# EAGLE design RTI-Dome-eth-ESP32 (EAGLE 9.7.0)

## Sheet 1 of 2
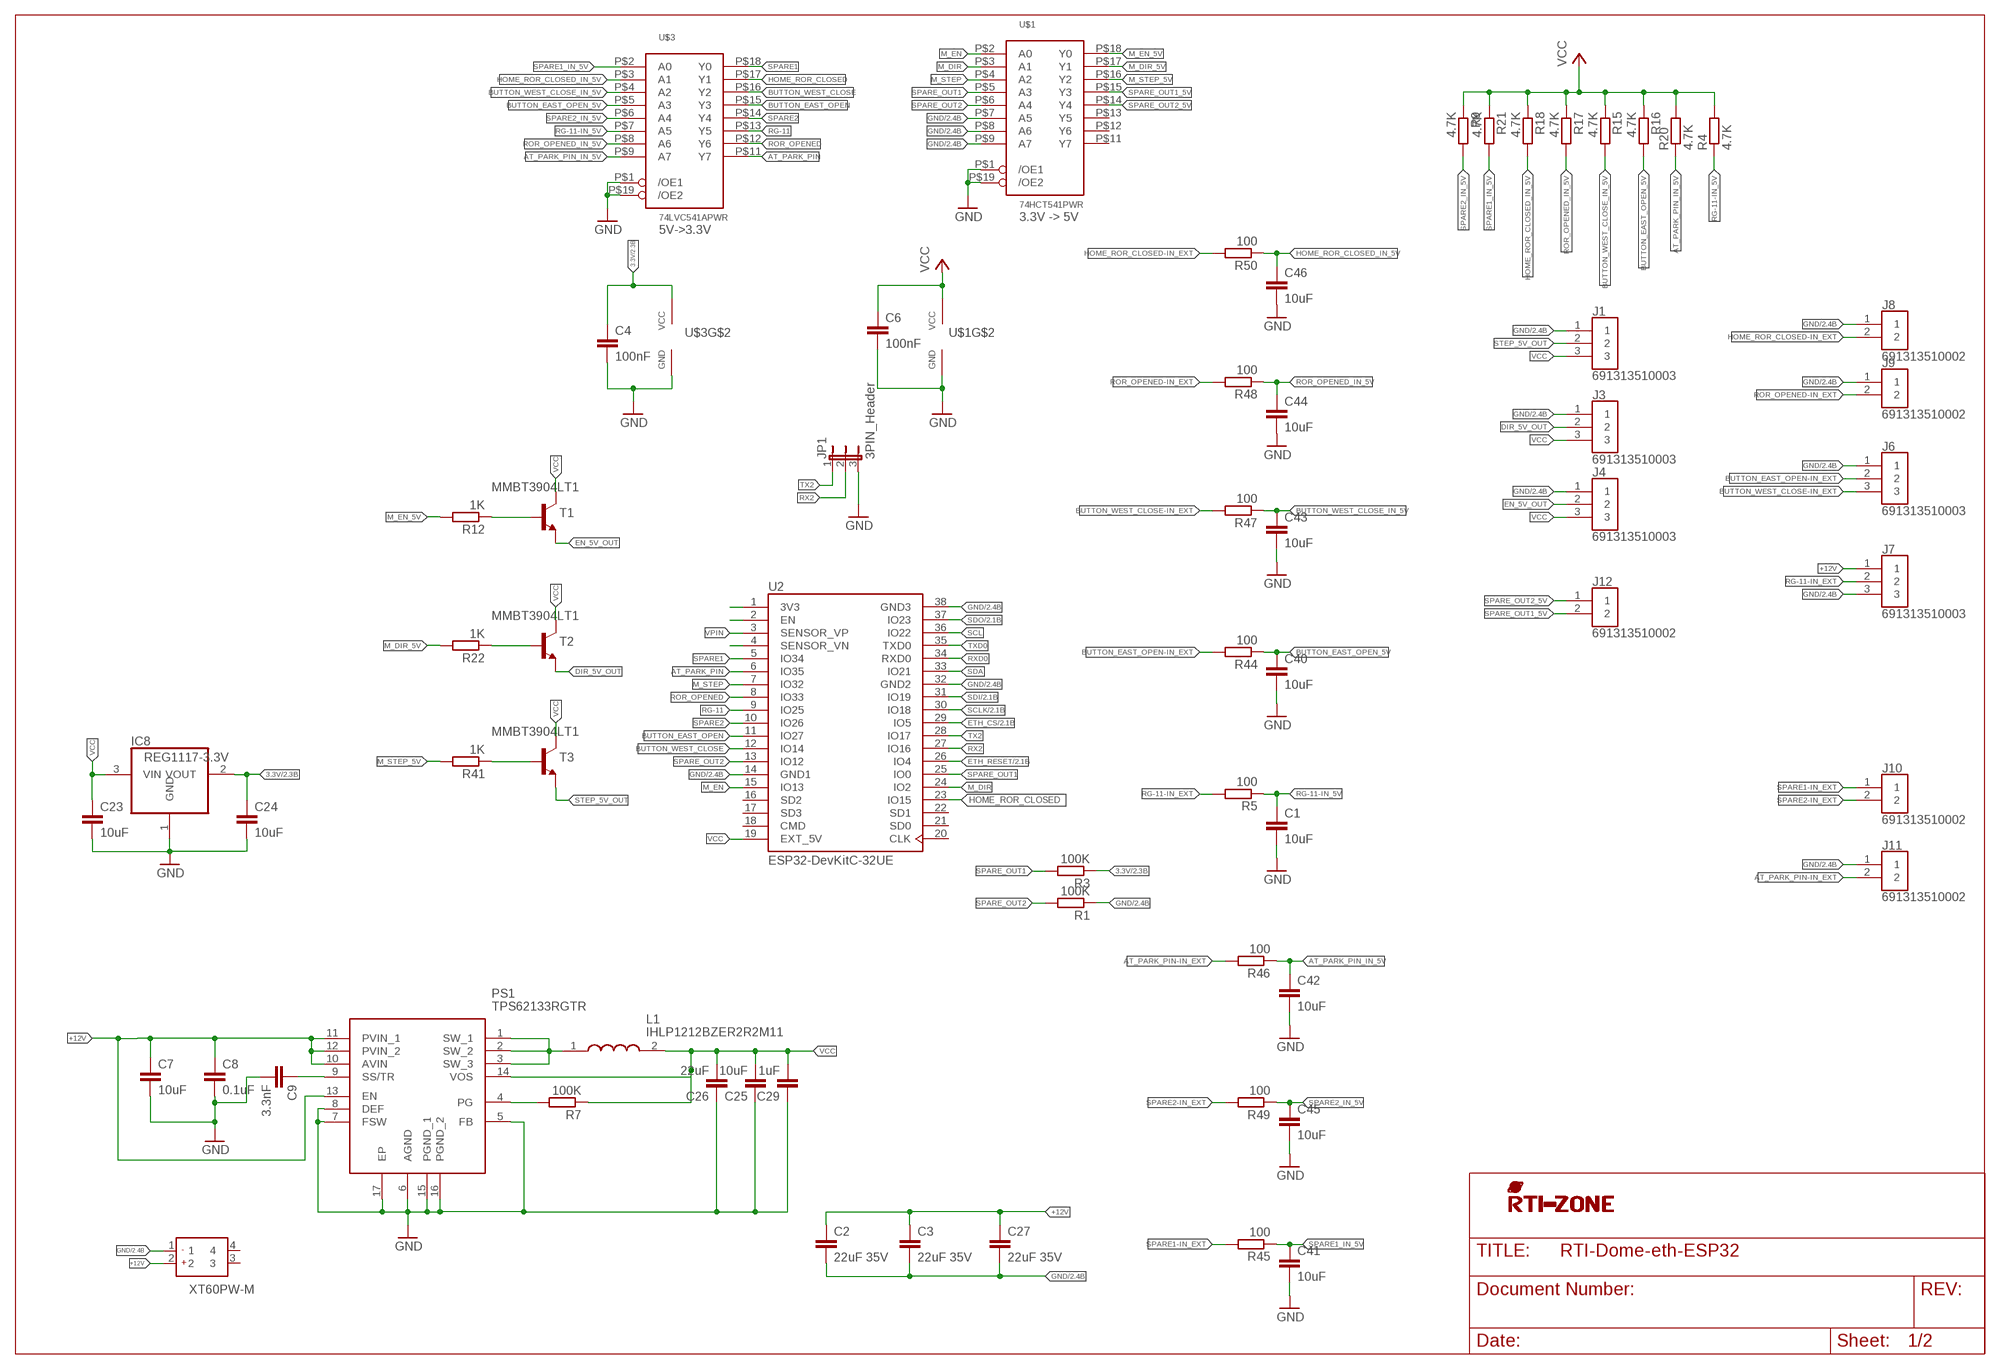
[diagram p0: schematic, sheet 1]

### Parts
C1  10uF  C-EUC0603  [C0603]
C2  22uF 35V  C-EUC1206  [C1206]
C3  22uF 35V  C-EUC1206  [C1206]
C4  100nF  C-EUC0603  [C0603]
C6  100nF  C-EUC0603  [C0603]
C7  10uF  C-EUC1206  [C1206]
C8  0.1uF  C-EUC1206  [C1206]
C9  3.3nF  C-EUC0805  [C0805]
C23  10uF  C-EUC0603  [C0603]
C24  10uF  C-EUC0603  [C0603]
C25  10uF  C-EUC0805  [C0805]
C26  22uF  C-EUC0805  [C0805]
C27  22uF 35V  C-EUC1206  [C1206]
C29  1uF  C-EUC0805  [C0805]
C40  10uF  C-EUC0603  [C0603]
C41  10uF  C-EUC0603  [C0603]
C42  10uF  C-EUC0603  [C0603]
C43  10uF  C-EUC0603  [C0603]
C44  10uF  C-EUC0603  [C0603]
C45  10uF  C-EUC0603  [C0603]
C46  10uF  C-EUC0603  [C0603]
IC8  REG1117-3.3V  REG1117  [SOT223]
J1  691313510003  [691313510003]
J2  XT60PW-M  [XT60PWM]
J3  691313510003  [691313510003]
J4  691313510003  [691313510003]
J6  691313510003  [691313510003]
J7  691313510003  [691313510003]
J8  691313510002  [SHDRRA2W100P0X508_1X2_1216X120]
J9  691313510002  [SHDRRA2W100P0X508_1X2_1216X120]
J10  691313510002  [SHDRRA2W100P0X508_1X2_1216X120]
J11  691313510002  [SHDRRA2W100P0X508_1X2_1216X120]
J12  691313510002  [SHDRRA2W100P0X508_1X2_1216X120]
JP1  3PIN_Header  JP2E  [JP2]
L1  IHLP1212BZER2R2M11  [INDPM3630X200N]
PS1  TPS62133RGTR  [QFN50P300X300X100-17N]
R1  100K  R-EU'0603'  [R0603]
R3  100K  R-EU'0603'  [R0603]
R4  4.7K  R-EU_R0603  [R0603]
R5  100  R-EU_R0603  [R0603]
R7  100K  R-EU_R0603  [R0603]
R9  4.7K  R-EU_R0603  [R0603]
R12  1K  R-EU_R0603  [R0603]
R15  4.7K  R-EU_R0603  [R0603]
R16  4.7K  R-EU_R0603  [R0603]
R17  4.7K  R-EU_R0603  [R0603]
R18  4.7K  R-EU_R0603  [R0603]
R20  4.7K  R-EU_R0603  [R0603]
R21  4.7K  R-EU_R0603  [R0603]
R22  1K  R-EU_R0603  [R0603]
R41  1K  R-EU_R0603  [R0603]
R44  100  R-EU_R0603  [R0603]
R45  100  R-EU_R0603  [R0603]
R46  100  R-EU_R0603  [R0603]
R47  100  R-EU_R0603  [R0603]
R48  100  R-EU_R0603  [R0603]
R49  100  R-EU_R0603  [R0603]
R50  100  R-EU_R0603  [R0603]
T1  MMBT3904LT1  [SOT23]
T2  MMBT3904LT1  [SOT23]
T3  MMBT3904LT1  [SOT23]
U2  ESP32-DevKitC-32UE  ESP32-DEVKITC-32U  [MODULE_ESP32-DEVKITC-32U]
U$1  74HCT541PWR  74541B  [TSSOP20]
U$3  74LVC541APWR  74541B  [TSSOP20]
U$4  RTI-LOGO_BIG  [LOGO_BIG]

### Nets
3.3V: C4.1 C24.1 IC8.2(VOUT) R3.1 U$3.P$20(VCC) ; also sheet 2
+12V [+12V]: C2.1 C3.1 C7.1 C8.1 C27.1 J2.2 J7.1 PS1.10(AVIN) PS1.11(PVIN_1) PS1.12(PVIN_2) PS1.13(EN)
AT_PARK_PIN: U2.6(IO35) U$3.P$11(Y7)
AT_PARK_PIN-IN_EXT: J11.2 R46.2
AT_PARK_PIN_IN_5V: C42.1 R20.1 R46.1 U$3.P$9(A7)
BUTTON_EAST_OPEN: U2.11(IO27) U$3.P$15(Y3)
BUTTON_EAST_OPEN-IN_EXT: J6.2 R44.2
BUTTON_EAST_OPEN_5V: C40.1 R16.2 R44.1 U$3.P$5(A3)
BUTTON_WEST_CLOSE: U2.12(IO14) U$3.P$16(Y2)
BUTTON_WEST_CLOSE-IN_EXT: J6.3 R47.2
BUTTON_WEST_CLOSE_IN_5V: C43.1 R15.2 R47.1 U$3.P$4(A2)
DIR-5V_TR: R22.1 T2.1(B)
DIR_5V_OUT: J3.2 T2.2(E)
EN-5V_TR: R12.1 T1.1(B)
EN_5V_OUT: J4.2 T1.2(E)
ETH_CS: U2.29(IO5) ; also sheet 2
ETH_RESET: U2.26(IO4) ; also sheet 2
GND [GND]: C1.2 C2.2 C3.2 C4.2 C6.2 C7.2 C8.2 C9.2 C23.2 C24.2 C25.1 C26.1 C27.2 C29.1 C40.2 C41.2 C42.2 C43.2 C44.2 C45.2 C46.2 IC8.1(GND) J1.1 J2.1 J3.1 J4.1 J6.1 J7.3 J8.1 J9.1 J11.1 JP1.3 PS1.5(FB) PS1.6(AGND) PS1.7(FSW) PS1.8(DEF) PS1.15(PGND_1) PS1.16(PGND_2) PS1.17(EP) R1.1 U2.14(GND1) U2.32(GND2) U2.38(GND3) U$1.P$1(/OE1) U$1.P$7(A5) U$1.P$8(A6) U$1.P$9(A7) U$1.P$10(GND) U$1.P$19(/OE2) U$3.P$1(/OE1) U$3.P$10(GND) U$3.P$19(/OE2) ; also sheet 2
HOME_ROR_CLOSED: U2.23(IO15) U$3.P$17(Y1)
HOME_ROR_CLOSED-IN_EXT: J8.2 R50.2
HOME_ROR_CLOSED_IN_5V: C46.1 R18.2 R50.1 U$3.P$3(A1)
M_DIR: U2.24(IO2) U$1.P$3(A1)
M_DIR_5V: R22.2 U$1.P$17(Y1)
M_EN: U2.15(IO13) U$1.P$2(A0)
M_EN_5V: R12.2 U$1.P$18(Y0)
M_STEP: U2.7(IO32) U$1.P$4(A2)
M_STEP_5V: R41.2 U$1.P$16(Y2)
N$20: U2.1(3V3)
N$21: U2.2(EN)
N$36: U2.4(SENSOR_VN)
PG: PS1.4(PG) R7.2
RG-11: U2.9(IO25) U$3.P$13(Y5)
RG-11-IN_5V: C1.1 R4.1 R5.1 U$3.P$7(A5)
RG-11-IN_EXT: J7.2 R5.2
ROR_OPENED: U2.8(IO33) U$3.P$12(Y6)
ROR_OPENED-IN_EXT: J9.2 R48.2
ROR_OPENED_IN_5V: C44.1 R17.2 R48.1 U$3.P$8(A6)
RX2: JP1.2 U2.27(IO16)
RXD0: U2.34(RXD0)
SCL: U2.36(IO22)
SCLK: U2.30(IO18) ; also sheet 2
SDA: U2.33(IO21)
SDI: U2.31(IO19) ; also sheet 2
SDO: U2.37(IO23) ; also sheet 2
SPARE1: U2.5(IO34) U$3.P$18(Y0)
SPARE1-IN_EXT: J10.1 R45.2
SPARE1_IN_5V: C41.1 R21.2 R45.1 U$3.P$2(A0)
SPARE2: U2.10(IO26) U$3.P$14(Y4)
SPARE2-IN_EXT [GND]: J10.2 R49.2
SPARE2_IN_5V [GND]: C45.1 R9.2 R49.1 U$3.P$6(A4)
SPARE_OUT1: R3.2 U2.25(IO0) U$1.P$5(A3)
SPARE_OUT1_5V: J12.2 U$1.P$15(Y3)
SPARE_OUT2: R1.2 U2.13(IO12) U$1.P$6(A4)
SPARE_OUT2_5V: J12.1 U$1.P$14(Y4)
SS/TR: C9.1 PS1.9(SS/TR)
STEP-5V_TR: R41.1 T3.1(B)
STEP_5V_OUT: J1.2 T3.2(E)
SW: L1.1 PS1.1(SW_1) PS1.2(SW_2) PS1.3(SW_3)
TX2: JP1.1 U2.28(IO17)
TXD0: U2.35(TXD0)
VCC: C6.1 C23.1 C25.2 C26.2 C29.2 IC8.3(VIN) J1.3 J3.3 J4.3 L1.2 PS1.14(VOS) R4.2 R7.1 R9.1 R15.1 R16.1 R17.1 R18.1 R20.2 R21.1 T1.3(C) T2.3(C) T3.3(C) U2.19(EXT_5V) U$1.P$20(VCC)
VPIN: U2.3(SENSOR_VP)
Unconnected: J2.3 J2.4 U2.16(SD2) U2.17(SD3) U2.18(CMD) U2.20(CLK) U2.21(SD0) U2.22(SD1) U$1.P$11(Y7) U$1.P$12(Y6) U$1.P$13(Y5)

### Notes on the sheet
- 3.3V -> 5V
- 5V->3.3V

## Sheet 2 of 2
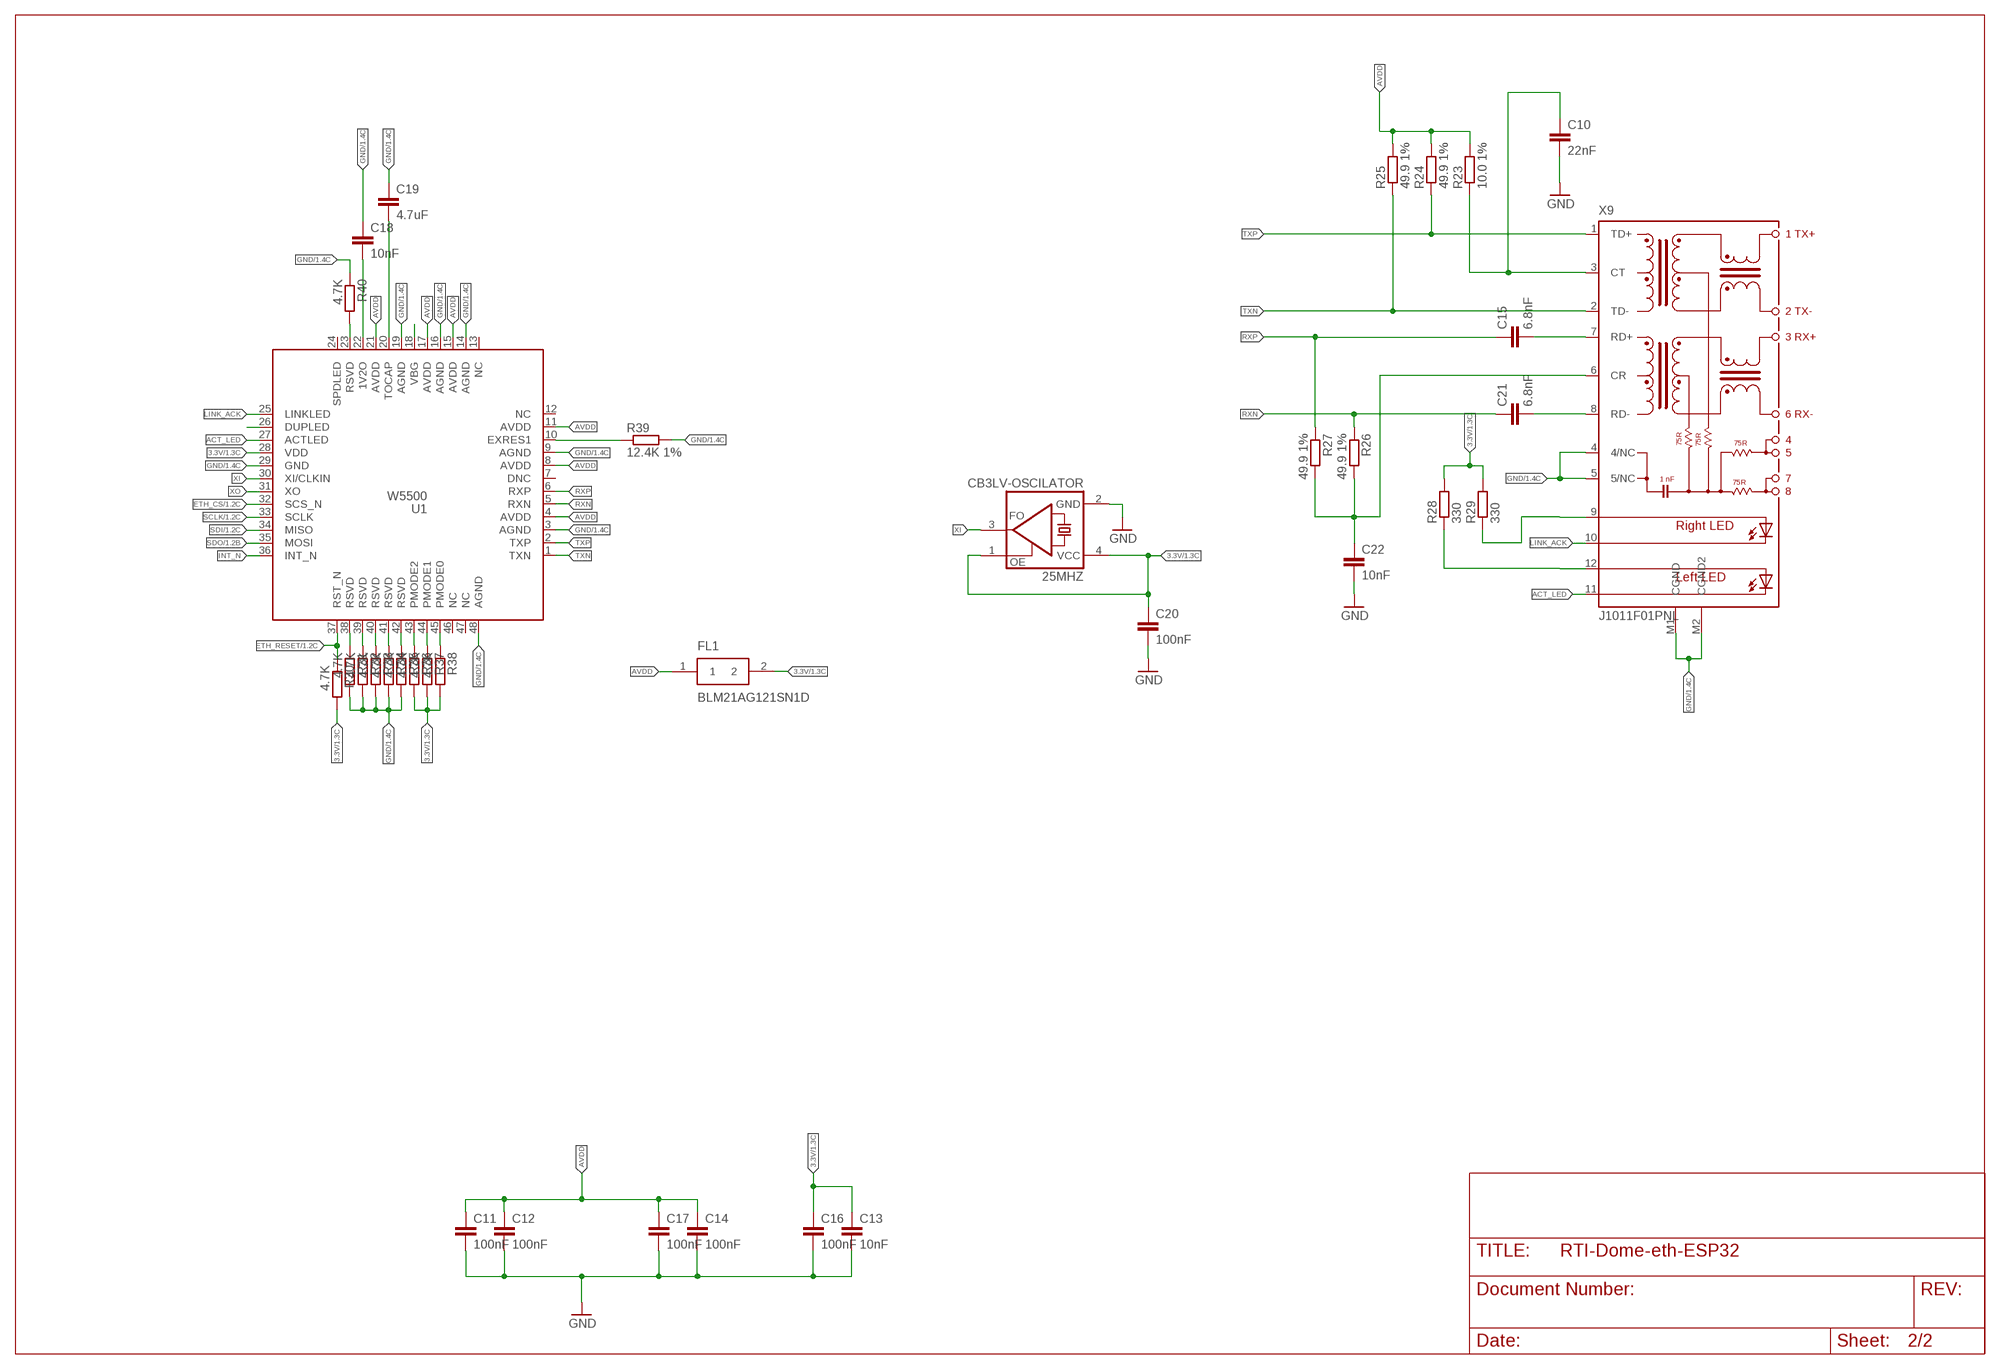
[diagram p1: schematic, sheet 2]

### Parts
25MHZ  CB3LV-OSCILATOR  [SMD-7050_4P]
C10  22nF  C-EUC0603  [C0603]
C11  100nF  C-EUC0603  [C0603]
C12  100nF  C-EUC0603  [C0603]
C13  10nF  C-EUC0603  [C0603]
C14  100nF  C-EUC0603  [C0603]
C15  6.8nF  C-EUC0603  [C0603]
C16  100nF  C-EUC0603  [C0603]
C17  100nF  C-EUC0603  [C0603]
C18  10nF  C-EUC0603  [C0603]
C19  4.7uF  C-EUC0603  [C0603]
C20  100nF  C-EUC0603  [C0603]
C21  6.8nF  C-EUC0603  [C0603]
C22  10nF  C-EUC0603  [C0603]
FL1  BLM21AG121SN1D  [L0805]
R23  10.0 1%  R-EU_R0603  [R0603]
R24  49.9 1%  R-EU_R0603  [R0603]
R25  49.9 1%  R-EU_R0603  [R0603]
R26  49.9 1%  R-EU_R0603  [R0603]
R27  49.9 1%  R-EU_R0603  [R0603]
R28  330  R-EU_R0603  [R0603]
R29  330  R-EU_R0603  [R0603]
R30  4.7K  R-EU_R0603  [R0603]
R31  4.7K  R-EU_R0603  [R0603]
R32  4.7K  R-EU_R0603  [R0603]
R33  4.7K  R-EU_R0603  [R0603]
R34  4.7K  R-EU_R0603  [R0603]
R35  4.7K  R-EU_R0603  [R0603]
R36  4.7K  R-EU_R0603  [R0603]
R37  4.7K  R-EU_R0603  [R0603]
R38  4.7K  R-EU_R0603  [R0603]
R39  12.4K 1%  R-EU_R0603  [R0603]
R40  4.7K  R-EU_R0603  [R0603]
U1  W5500  [LQFP48]
X9  J1011F01PNL  [J1011F01PNL]

### Nets
3.3V: 25MHZ.1(OE) 25MHZ.4(VDD) C13.1 C16.1 C20.1 FL1.2 R28.2 R29.2 R30.2 R36.2 R37.2 R38.2 U1.28(VDD) ; also sheet 1
ACT_LED: U1.27(ACTLED) X9.11(C-L)
AVDD: C11.1 C12.1 C14.1 C17.1 FL1.1 R23.2 R24.2 R25.2 U1.4(AVDD) U1.8(AVDD) U1.11(AVDD) U1.15(AVDD) U1.17(AVDD) U1.21(AVDD)
CR [+3V3]: C22.1 R26.2 R27.2 X9.6(CR)
CT [+3V3]: C10.1 R23.1 X9.3(CT)
ETH_CS: U1.32(SCS_N) ; also sheet 1
ETH_RESET: R30.1 U1.37(RST_N) ; also sheet 1
GND [GND]: 25MHZ.2(GND) C10.2 C11.2 C12.2 C13.2 C14.2 C16.2 C17.2 C18.1 C19.1 C20.2 C22.2 R31.2 R32.2 R33.2 R34.2 R35.2 R39.2 R40.1 U1.3(AGND) U1.9(AGND) U1.14(AGND) U1.16(AGND) U1.19(AGND) U1.29(GND) U1.48(AGND) X9.4(4/NC) X9.5(5/NC) X9.M1(CGND) X9.M2(CGND2) ; also sheet 1
INT_N: U1.36(INT_N)
L_LED+: R28.1 X9.12(AL)
LINK_ACK: U1.25(LINKLED) X9.10(C-R)
N$17: U1.26(DUPLED)
N$22: R31.1 U1.38(RSVD)
N$23: R32.1 U1.39(RSVD)
N$24: R33.1 U1.40(RSVD)
N$25: R34.1 U1.41(RSVD)
N$26: R35.1 U1.42(RSVD)
N$27: R36.1 U1.43(PMODE2)
N$28: R37.1 U1.44(PMODE1)
N$29: R38.1 U1.45(PMODE0)
N$31: C19.2 U1.20(TOCAP)
N$32: U1.18(VBG)
N$33: C18.2 U1.22(1V2O)
N$34: R39.1 U1.10(EXRES1)
N$35: R40.2 U1.23(RSVD)
R_LED+: R29.1 X9.9(A-R)
RD+: C15.2 X9.7(RD+)
RD-: C21.2 X9.8(RD-)
RXN: C21.1 R26.1 U1.5(RXN)
RXP: C15.1 R27.1 U1.6(RXP)
SCLK: U1.33(SCLK) ; also sheet 1
SDI: U1.34(MISO) ; also sheet 1
SDO: U1.35(MOSI) ; also sheet 1
TXN [diff]: R25.1 U1.1(TXN) X9.2(TD-)
TXP: R24.1 U1.2(TXP) X9.1(TD+)
XI: 25MHZ.3(FO) U1.30(XI/CLKIN)
XO: U1.31(XO)
Unconnected: U1.7(DNC) U1.12(NC) U1.13(NC) U1.24(SPDLED) U1.46(NC) U1.47(NC)

## Library data of the parts
25MHZ = rti:CB3LV-OSCILATOR; MPN: CB3LV-3I-25M0000
C1 C23 C24 C40-C46 = rcl:C-EU: CAPACITOR, European symbol; MPN: CC0805KKX5R8BB106; SPICEPREFIX: C
C2 C3 C7-C9 C25-C27 C29 = rcl:C-EU: CAPACITOR, European symbol; SPICEPREFIX: C
C4 C6 C11 C12 C14 C16 C17 C20 = rcl:C-EU: CAPACITOR, European symbol; MPN: 0805YD104KAT2A; SPICEPREFIX: C
C10 = rcl:C-EU: CAPACITOR, European symbol; MPN: CC0805JRX7R8BB223; SPICEPREFIX: C
C13 C18 C22 = rcl:C-EU: CAPACITOR, European symbol; MPN: CC0805KRX7R9BB103; SPICEPREFIX: C
C15 C21 = rcl:C-EU: CAPACITOR, European symbol; MPN: C0805C682F4HACTU; SPICEPREFIX: C
C19 = rcl:C-EU: CAPACITOR, European symbol; MPN: C0805C475J3RACTU; SPICEPREFIX: C
FL1 = BLM21AG121SN1D:BLM21AG121SN1D: BLM21_N1D Series EMI Suppression Filter 120+/-25% at 100MHz 1A @85 Source: Datasheet <https://www.murata.com/en-us/products/productdetail?partno=BLM21AG121SN1#>; MPN: BLM21AG121SN1D
IC8 = burr-brown:REG1117: 800mA and 1A Low Dropout (LDO) Positive Regulator 1.8V, 2.5V, 2.85V, 3.3V, 5V, and Adj; MPN: REG1117-3.3/2K5; OC_FARNELL: 1097566; OC_NEWARK: 14P6981
J1 J3 J4 J6 J7 = samacsys:691313510003: Wurth Elektronik 313 Series 5.08mm Pitch Straight Pluggable Terminal Block, PCB Header, Through Hole, 3 Way Source: Datasheet <https://katalog.we-online.de/em/datasheet/6913135100xx.pdf>; DESCRIPTION: Wurth Elektronik 313 Series 5.08mm Pitch Straight Pluggable Terminal Block, PCB Header, Through Hole, 3 Way; HEIGHT: 8.7mm; MANUFACTURER_NAME: Wurth Elektronik; MANUFACTURER_PART_NUMBER: 691313510003; MOUSER_PART_NUMBER: 710-691313510003; MOUSER_PRICE-STOCK: https://www.mouser.co.uk/ProductDetail/Wurth-Elektronik/691313510003?qs=E2PpAYvlWVuriHHnVOgTEg%3D%3D
J2 = samacsys:XT60PW-M: Socket; DC supply; XT60; male; PIN: 2; on PCBs; THT; Colour: yellow Source: Datasheet <https://www.tme.eu/Document/9b8d0c5eb7094295f3d3112c214d3ade/XT60PW SPEC.pdf>; DESCRIPTION: Socket; DC supply; XT60; male; PIN: 2; on PCBs; THT; Colour: yellow; HEIGHT: 8.4mm; LCSC_PART: C98732; MANUFACTURER_NAME: Changzou Amass Elec; MANUFACTURER_PART_NUMBER: XT60PW-M; MPN: XT60PW-M
J8-J12 = samacsys:691313510002: 2 Position Terminal Block Header, Male Pins, Shrouded (4 Side) 0.200" (5.08mm) 90, Right Angle Through Hole Source: Datasheet <https://www.we-online.de/katalog/datasheet/6913135100xx.pdf>; DESCRIPTION: 2 Position Terminal Block Header, Male Pins, Shrouded (4 Side) 0.200" (5.08mm) 90, Right Angle Through Hole; HEIGHT: 8.5mm; MANUFACTURER_NAME: Wurth Elektronik; MANUFACTURER_PART_NUMBER: 691313510002; MOUSER_PART_NUMBER: 710-691313510002; MOUSER_PRICE-STOCK: https://www.mouser.co.uk/ProductDetail/Wurth-Elektronik/691313510002?qs=2kOmHSv6VfR6BrMDgUh3kQ%3D%3D
JP1 = rti:JP2E: JUMPER; LCSC_PART: C19190477
L1 = samacsys:IHLP1212BZER2R2M11: Vishay IHLP1212BZ-11 Series Shielded Wire-wound SMD Inductor with a Metal Composite Core, 2.2 uH +/-20% Wire-Wound 3A Idc Source: Datasheet <https://www.vishay.com/docs/34289/lp12bz11.pdf>; ARROW_PART_NUMBER: IHLP1212BZER2R2M11; ARROW_PRICE-STOCK: https://www.arrow.com/en/products/ihlp1212bzer2r2m11/vishay?region=nac; DESCRIPTION: Vishay IHLP1212BZ-11 Series Shielded Wire-wound SMD Inductor with a Metal Composite Core, 2.2 uH +/-20% Wire-Wound 3A Idc; HEIGHT: 2mm; LCSC_PART: C553996; MANUFACTURER_NAME: Vishay; MANUFACTURER_PART_NUMBER: IHLP1212BZER2R2M11; MOUSER_PART_NUMBER: 70-IHLP1212BZER2R2M1; MOUSER_PRICE-STOCK: https://www.mouser.co.uk/ProductDetail/Vishay-Dale/IHLP1212BZER2R2M11?qs=OXt1GPNndFc1xOXvysj2ew%3D%3D
PS1 = samacsys:TPS62133RGTR: 3-17V 3A Step-Down Converter in 3x3 QFN Package Source: Datasheet <http://www.ti.com/lit/gpn/tps62133>; ARROW_PART_NUMBER: TPS62133RGTR; ARROW_PRICE-STOCK: https://www.arrow.com/en/products/tps62133rgtr/texas-instruments?region=nac; DESCRIPTION: 3-17V 3A Step-Down Converter in 3x3 QFN Package; HEIGHT: 1mm; LCSC_PART: C73973; MANUFACTURER_NAME: Texas Instruments; MANUFACTURER_PART_NUMBER: TPS62133RGTR; MOUSER_PART_NUMBER: 595-TPS62133RGTR; MOUSER_PRICE-STOCK: https://www.mouser.co.uk/ProductDetail/Texas-Instruments/TPS62133RGTR?qs=gXEV9p%2FxLgfynMj9v6Z0Jw%3D%3D
R1 R3 = rti:R-EU; MPN: RT0805FRD07100RL
R4 R9 R12 R15-R18 R20-R22 R30-R38 R40 R41 = rcl:R-EU_: RESISTOR, European symbol; MPN: RT0805FRE074K7L; SPICEPREFIX: R
R5 R44-R50 = rcl:R-EU_: RESISTOR, European symbol; MPN: RT0805FRD07100RL; SPICEPREFIX: R
R7 = rcl:R-EU_: RESISTOR, European symbol; SPICEPREFIX: R
R23 = rcl:R-EU_: RESISTOR, European symbol; MPN: C881123; SPICEPREFIX: R
R24-R27 = rcl:R-EU_: RESISTOR, European symbol; MPN: RC0805FR-0749R9L; SPICEPREFIX: R
R28 R29 = rcl:R-EU_: RESISTOR, European symbol; MPN: RC0805JR-07330RL; SPICEPREFIX: R
R39 = rcl:R-EU_: RESISTOR, European symbol; MPN: RC0805FR-0712K4L; SPICEPREFIX: R
T1-T3 = samacsys:MMBT3904LT1: NPN TRANSISTOR
U1 = W5500:W5500; MPN: W5500
U2 = ESP32-DEVKITC-32D:ESP32-DEVKITC-32: Check availability <https://pricing.snapeda.com/parts/ESP32-DEVKITC-32D/Espressif%20Systems/view-part?ref=eda>
U$1 = rti:74*541: Octal non inverting buffer; LCSC_PART: C131314
U$3 = rti:74*541: Octal non inverting buffer; LCSC_PART: C6093
U$4 = rti:RTI-LOGO
X9 = rti:J1011F01PNL: PULSEJACK (TM) 1x1 Tab-UP RJ45 10/100 Base-TX RJ45 1x1 Tab-UP with LEDs 8-pin (J1 series) and 6-pin (JP series) integrated magnetics connector, designed to support applications, such as ADSL modems, LAN-on-Motherboard, and Hub and Switches. Source: www.pulseeng.com .. PulseJack-J402.pdf

## Board
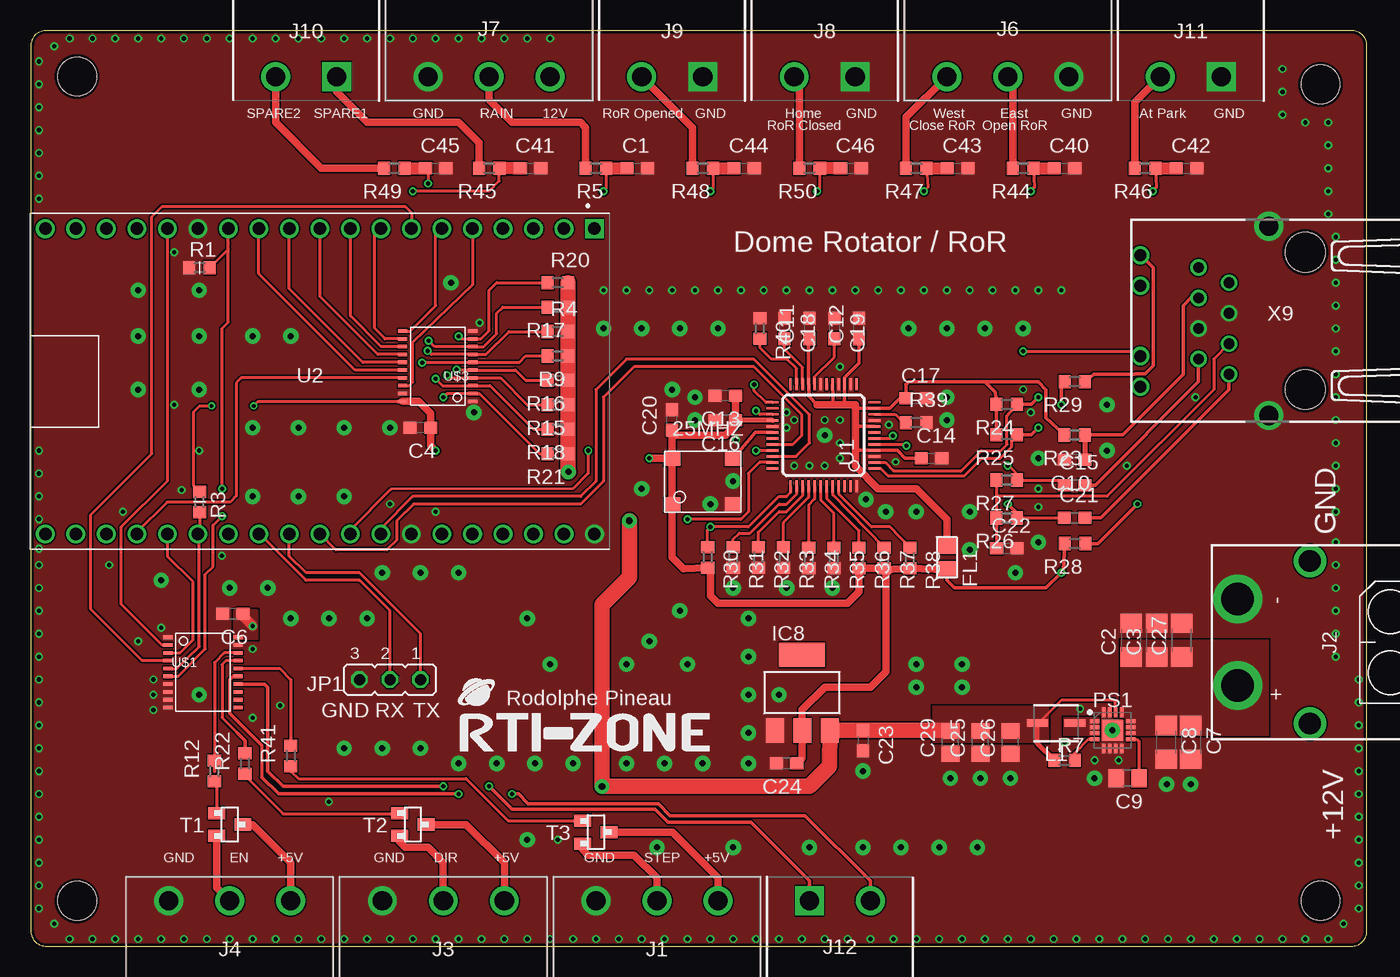
[diagram p2: board, top side]
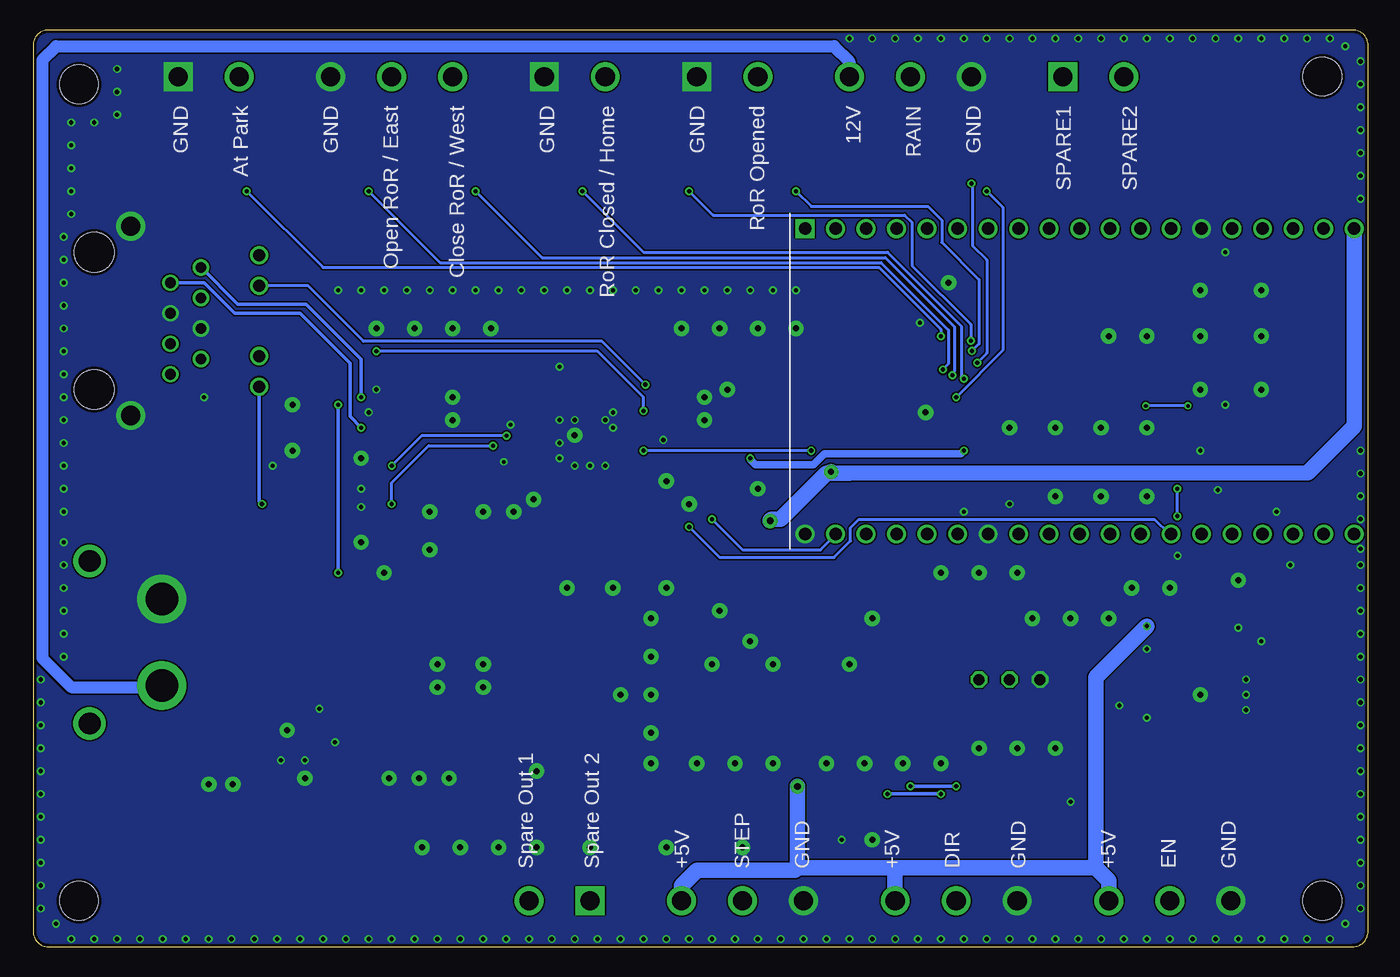
[diagram p3: board, bottom side, seen from below]

Size 111.13 x 76.27 mm. Coordinates in mm from the lower left corner, seen from the top.
Outline: 0,75.01 arc-90 1.26,76.27 109.87,76.27 arc-90 111.13,75.01 111.13,1.26 arc-90 109.87,0 1.26,0 arc-90 0,1.26 0,75.01
Copper layers (1*16): Top 0.35mm / dielectric 1.6mm / Bottom 0.35mm
Design rules "jlcpcb2layer.dru *": minimum track width 5mil, minimum drill 0.2mm, track to track 5mil, track to pad 5mil, pad to pad 5mil, via to via 5mil, smd to smd 5mil, copper to edge 10mil, drill to drill 0.5mm, minimum pad ring 6mil, minimum via ring 6mil, stop-mask expansion 0.05mm, vias tented up to drill 130mil, thermal gap 8mil
Holes 3.2 mm at 107.31,71.75 107.31,3.81 3.81,3.81 3.81,72.39

### Footprints (pad centres in the part's own frame; a part is rotated, then mirrored left to right if it is on the bottom)
SMD-7050_4P = smd 1.397 x 1.194: 1 -2.54,-1.905; 2 2.54,-1.905; 3 2.54,1.905; 4 -2.54,1.905
C0603 = smd 1.1 x 1: 1 -0.85,0; 2 0.85,0
C1206 = smd 1.6 x 1.8: 1 -1.4,0; 2 1.4,0
C0805 = smd 1.3 x 1.5: 1 -0.95,0; 2 0.95,0
L0805 = smd 1.3 x 1.5: 1 -0.95,0; 2 0.95,0
SOT223 = smd 1.499 x 2.007: 1 -2.261,-3.15; 2 0.025,-3.15; 3 2.311,-3.15 | smd 3.81 x 2.007: 4 0,3.15
691313510003 = drill 1.6 pad 2.4: 1 -5.08,0; 2 0,0; 3 5.08,0
XT60PWM = drill 2.7 pad 4.05: 1 -3.6,0; 2 3.6,0 | drill 1.8 pad 2.7: 3 6.75,6; 4 -6.75,6
SHDRRA2W100P0X508_1X2_1216X120 = drill 1.6 pad 2.4 square: 1 -2.54,0 | drill 1.6 pad 2.4: 2 2.54,0
JP2 = drill 0.914 octagon: 1 -2.54,0; 2 0,0; 3 2.54,0
INDPM3630X200N = smd 1.75 x 0.6: 1 -1.55,0; 2 1.55,0
QFN50P300X300X100-17N = smd 0.8 x 0.3: 1 -1.5,0.75; 2 -1.5,0.25; 3 -1.5,-0.25; 4 -1.5,-0.75; 9 1.5,-0.75; 10 1.5,-0.25; 11 1.5,0.25; 12 1.5,0.75 | smd 0.3 x 0.8: 5 -0.75,-1.5; 6 -0.25,-1.5; 7 0.25,-1.5; 8 0.75,-1.5; 13 0.75,1.5; 14 0.25,1.5; 15 -0.25,1.5; 16 -0.75,1.5 | smd 1.75 x 1.75: 17 0,0
R0603 = smd 1 x 1.1: 1 -0.85,0; 2 0.85,0
SOT23 = smd 1.4 x 1: 1 1.1,-0.95; 2 1.1,0.95; 3 -1.1,0
LQFP48 = smd 0.2 x 1: 1 -2.75,-4.25; 2 -2.25,-4.25; 3 -1.75,-4.25; 4 -1.25,-4.25; 5 -0.75,-4.25; 6 -0.25,-4.25; 7 0.25,-4.25; 8 0.75,-4.25; 9 1.25,-4.25; 10 1.75,-4.25; 11 2.25,-4.25; 12 2.75,-4.25; 25 2.75,4.25; 26 2.25,4.25; 27 1.75,4.25; 28 1.25,4.25; 29 0.75,4.25; 30 0.25,4.25; 31 -0.25,4.25; 32 -0.75,4.25; 33 -1.25,4.25; 34 -1.75,4.25; 35 -2.25,4.25; 36 -2.75,4.25 | smd 1 x 0.2: 13 4.25,-2.75; 14 4.25,-2.25; 15 4.25,-1.75; 16 4.25,-1.25; 17 4.25,-0.75; 18 4.25,-0.25; 19 4.25,0.25; 20 4.25,0.75; 21 4.25,1.25; 22 4.25,1.75; 23 4.25,2.25; 24 4.25,2.75; 37 -4.25,2.75; 38 -4.25,2.25; 39 -4.25,1.75; 40 -4.25,1.25; 41 -4.25,0.75; 42 -4.25,0.25; 43 -4.25,-0.25; 44 -4.25,-0.75; 45 -4.25,-1.25; 46 -4.25,-1.75; 47 -4.25,-2.25; 48 -4.25,-2.75
MODULE_ESP32-DEVKITC-32U = drill 1.04 square: 1 -12.7,20.32 | drill 1.04: 2 -12.7,17.78; 3 -12.7,15.24; 4 -12.7,12.7; 5 -12.7,10.16; 6 -12.7,7.62; 7 -12.7,5.08; 8 -12.7,2.54; 9 -12.7,0; 10 -12.7,-2.54; 11 -12.7,-5.08; 12 -12.7,-7.62; 13 -12.7,-10.16; 14 -12.7,-12.7; 15 -12.7,-15.24; 16 -12.7,-17.78; 17 -12.7,-20.32; 18 -12.7,-22.86; 19 -12.7,-25.4; 20 12.7,-25.4; 21 12.7,-22.86; 22 12.7,-20.32; 23 12.7,-17.78; 24 12.7,-15.24; 25 12.7,-12.7; 26 12.7,-10.16; 27 12.7,-7.62; 28 12.7,-5.08; 29 12.7,-2.54; 30 12.7,0; 31 12.7,2.54; 32 12.7,5.08; 33 12.7,7.62; 34 12.7,10.16; 35 12.7,12.7; 36 12.7,15.24; 37 12.7,17.78; 38 12.7,20.32
TSSOP20 = smd 0.3 x 0.75: P$1 -2.885,-2.94; P$2 -2.235,-2.94; P$3 -1.585,-2.94; P$4 -0.935,-2.94; P$5 -0.285,-2.94; P$6 0.365,-2.94; P$7 1.015,-2.94; P$8 1.665,-2.94; P$9 2.315,-2.94; P$10 2.965,-2.94; P$11 2.965,2.91; P$12 2.315,2.91; P$13 1.665,2.91; P$14 1.015,2.91; P$15 0.365,2.91; P$16 -0.285,2.91; P$17 -0.935,2.91; P$18 -1.585,2.91; P$19 -2.235,2.91; P$20 -2.885,2.91
J1011F01PNL = drill 0.9 pad 1.3: 1 4.445,2.54; 2 3.175,0; 3 1.905,2.54; 4 0.635,0; 5 -0.635,2.54; 6 -1.905,0; 7 -3.175,2.54; 8 -4.445,0 | drill 1 pad 1.422: 9 5.465,7.37; 10 2.925,7.37; 11 -2.925,7.37; 12 -5.465,7.37 | drill 1.6 pad 2.184: M1 -7.875,-3.3; M2 7.875,-3.3 | hole 3.3: 5.715,-6.35; -5.715,-6.35

### Placement (x,y rotation side)
25MHZ  55.88,38.69 0 top
C1  50.44,64.77 0 top
C2  91.55,25.5 90 top
C3  93.65,25.5 90 top
C4  32.38,43.18 180 top
C6  16.76,27.69 180 top
C7  96.5,17 270 top
C8  94.45,17 270 top
C9  91.25,14 180 top
C10  86.84,40.51 180 top
C11  64.77,51.44 90 top
C12  68.9,51.44 90 top
C13  57.75,45.85 180 top
C14  74.93,40.64 0 top
C15  86.83,38.41 0 top
C16  57.75,43.78 180 top
C17  73.66,45.64 0 top
C18  62.71,51.44 270 top
C19  66.83,51.44 270 top
C20  53.34,43.81 90 top
C21  86.83,35.69 0 top
C22  81.19,33.15 0 top
C23  69.22,17.14 270 top
C24  62.87,15.24 180 top
C25  79,17 90 top
C26  81.5,17 90 top
C27  95.75,25.5 90 top
C29  76.5,17 90 top
C40  86,64.77 0 top
C41  41.55,64.77 0 top
C42  96.16,64.77 0 top
C43  77.11,64.77 0 top
C44  59.33,64.77 0 top
C45  33.66,64.77 0 top
C46  68.22,64.77 0 top
FL1  76.2,32.38 270 top
IC8  64.14,21.14 0 top
J1  52.07,3.81 0 top
J2  100.42,25.32 270 top
J3  34.29,3.81 0 top
J4  16.51,3.81 0 top
J6  81.28,72.39 180 top
J7  38.1,72.39 180 top
J8  66.04,72.39 180 top
J9  53.34,72.39 180 top
J10  22.86,72.39 180 top
J11  96.52,72.39 180 top
J12  67.31,3.81 0 top
JP1  29.84,22.23 180 top
L1  85.3,18.6 180 top
PS1  90,18 0 top
R1  14,56.5 0 top
R3  14,37 270 top
R4  43.81,51.18 0 top
R5  46.99,64.77 180 top
R7  86,15.5 0 top
R9  43.81,49.15 180 top
R12  15.24,14.61 90 top
R15  43.81,45.09 180 top
R16  43.81,47.12 180 top
R17  43.81,53.21 180 top
R18  43.81,43.05 180 top
R20  43.81,55.24 0 top
R21  43.81,41.02 180 top
R22  17.78,15.24 90 top
R23  86.84,42.58 180 top
R24  81.19,45.12 180 top
R25  81.19,42.6 180 top
R26  81.19,35.66 180 top
R27  81.19,38.82 180 top
R28  86.86,33.54 180 top
R29  86.86,47.01 180 top
R30  56.29,32.38 270 top
R31  58.42,32.38 270 top
R32  60.52,32.38 270 top
R33  62.61,32.38 270 top
R34  64.71,32.35 270 top
R35  66.8,32.35 270 top
R36  68.9,32.35 270 top
R37  70.99,32.35 270 top
R38  73.12,32.32 270 top
R39  73.66,43.6 0 top
R40  60.64,51.44 270 top
R41  21.59,15.88 90 top
R44  82.55,64.77 180 top
R45  38.1,64.77 180 top
R46  92.71,64.77 180 top
R47  73.66,64.77 180 top
R48  55.88,64.77 180 top
R49  30.21,64.77 180 top
R50  64.77,64.77 180 top
T1  16.51,10.16 180 top
T2  31.75,10.16 180 top
T3  46.99,9.53 180 top
U1  65.94,42.55 90 top
U2  26.55,47.04 270 top
U$1  14.3,22.86 270 top
U$3  33.8,48.26 90 top
U$4  35.69,16.26 0 top
X9  99.69,52.07 90 top

### Tracks (layer width: path | path; a pad name or v marks a point on that pad's centre or on a via)
3.3V  (via drill 0.3, 0.35)
  Top 0.254: FL1.2 76.14,31.38 76.14,31.37 | R3.1 13.5,38.35 13.5,44.5 14,45 v15,45 | v18.5,45 18.88,45.38 U$3.P$20
  Top 0.305: 58.7,43.46 C16.1 58.72,43.8 | R28.2 85.92,31.3 v85.72,31.11 84.45,29.84 76.83,29.84 76.2,30.48 FL1.2 | v85.72,45.09 85.72,46.73 R29.2
  Top 0.406: C20.1 53.66,42.55 | U1.28 58.72,43.8
  Top 0.61: 71.03,31.37 R38.2 76.14,31.37 | 71.03,31.37 R37.2 R36.2 68.9,29.53 67.94,28.57 57.15,28.57 56.52,29.21 56.52,31.21 R30.2 54.29,31.43 53.34,32.38 25MHZ.1 25MHZ.4 | C20.1 25MHZ.4 | 53.66,42.55 57.78,42.55 58.7,43.46 | C16.1 C13.1 | C24.1 64.16,15.69 IC8.2 64.16,19.71 66.04,21.59 69.85,21.59 71.12,22.86 71.12,31.28 71.03,31.37 | U$3.P$20 32.22,45.38 33.23,44.36 C4.1 33.23,41.7 v33.66,41.27 | 25MHZ.4 53.32,40.64 v51.44,40.64
  Bottom 0.254: v15,45 v18.5,45
  Bottom 0.305: v85.72,45.09 v85.72,31.11
  Bottom 0.61: v33.66,41.27 33.91,41.02 45.24,41.02 46.16,40.11 51,40.11 51.4,40.51 51.4,40.61 v51.44,40.64
+12V
  Bottom 1.016: J2.2 100.56,21.59 107.95,21.59 110.37,24.01 110.37,73.78 109.22,74.93 44.45,74.93 43.18,73.66 J7.1
  pour Top (no thermals): 91.11,19.04 91.14,19.01 91.14,17.59 103.01,17.59 103.01,25.51 90.64,25.51 90.64,19.04
ACT_LED  (via drill 0.35)
  Top 0.254: U1.27 60.61,44.3 v60.33,44.58 | v82.55,49.53 91.94,49.53 X9.11
  Bottom 0.254: v60.33,44.58 60.33,45.72 64.14,49.53 v82.55,49.53
AT_PARK_PIN
  Top 0.254: U$3.P$11 31.54,51.23 33.66,53.34 33.66,59.22 U2.6
AT_PARK_PIN-IN_EXT
  Top 0.61: R46.2 91.86,70.27 J11.2
AT_PARK_PIN_IN_5V  (via drill 0.35)
  Top 0.254: R46.1 93.66,63.18 v93.34,62.87 | R20.1 38.73,55.24 38.1,54.61 38.1,51.25 37.42,50.58 U$3.P$9 35.78,50.58 v35.56,50.8
  Top 1.016: R46.1 C42.1
  Bottom 0.254: v93.34,62.87 87,56.52 40.71,56.52 35.56,51.37 v35.56,50.8
AVDD
  Top 0.254: 72.31,45.64 72.47,45.64 | 67.7,45.33 67.94,45.09 | 68.87,44.8 68.58,45.09 | 68.69,43.3 68.58,43.18 | 66.7,45.11 66.67,45.09
  Top 0.305: 64.7,50.52 C11.1 64.69,50.51 U1.21 64.7,46.78 64.7,45.78 65.41,45.09 | C12.1 68.9,48.55 67.69,47.34 U1.15 67.69,45.34 67.7,45.33 | 72.47,45.64 C17.1 72.81,46.8 72.84,46.8 73.03,46.99 79.38,46.99 | 72.31,45.64 71.47,44.8 U1.11 68.87,44.8 | U1.8 68.69,43.3 | C14.1 72.73,40.64 72.07,41.3 U1.4 68.6,41.3 68.58,41.27 | U1.17 66.7,45.76 66.7,45.11 | R25.2 R24.2 80.24,46.12 79.38,46.99 | 79.38,46.99 83.82,46.99 84.45,46.35 84.45,44.01 R23.2
  Top 0.61: 65.41,45.09 66.67,45.09 67.94,45.09 68.58,45.09 68.58,43.18 68.58,41.27 68.58,40.01 70.48,38.1 73.66,38.1 76.2,35.56 FL1.1
BUTTON_EAST_OPEN
  Top 0.254: U$3.P$15 27.57,48.62 21.48,54.73 U2.11
BUTTON_EAST_OPEN-IN_EXT
  Top 0.61: R44.2 81.7,71.97 J6.2
BUTTON_EAST_OPEN_5V  (via drill 0.35)
  Top 0.254: R44.1 83.5,63.18 v83.19,62.87 | R16.2 41.15,47.12 40.29,47.98 U$3.P$5 35.43,47.98 v35.39,48.02
  Top 1.016: R44.1 C40.1
  Bottom 0.254: v83.19,62.87 77.24,56.92 40.54,56.92 34.92,51.31 34.92,48.51 35.26,48.18 35.26,48.15 v35.39,48.02
BUTTON_WEST_CLOSE
  Top 0.254: U$3.P$16 26.95,47.98 18.93,55.99 U2.12
BUTTON_WEST_CLOSE-IN_EXT
  Top 0.61: R47.2 72.81,69 J6.3
BUTTON_WEST_CLOSE_IN_5V  (via drill 0.35)
  Top 0.254: R47.1 74.61,63.18 v74.3,62.87 | R15.2 41.27,45.09 39.03,47.33 U$3.P$4 34.81,47.33 v34.59,47.55
  Top 1.016: R47.1 C43.1
  Bottom 0.254: v74.3,62.87 68.76,57.33 40.18,57.33 34.42,51.56 34.42,47.88 34.59,47.7 v34.59,47.55
CR
  Top 0.254: R27.2 80.34,37.47 80.37,37.47 | 80.37,37.47 80.34,37.46 R26.2 C22.1 | X9.6 98.42,48.9 98.42,46.35 89.53,37.47 80.37,37.47
CT
  Top 0.305: R23.1 90.84,42.58 95.89,47.62 95.89,53.34 96.52,53.98 X9.3
  Top 0.406: R23.1 C10.1
DIR-5V_TR
  Top 0.254: R22.1 17.78,14.22 20.95,11.05 30.59,11.05
  Top 0.305: 30.59,11.05 T2.1
DIR_5V_OUT
  Top 0.406: T2.2 30.65,8.72
  Top 0.61: 30.65,8.72 31.11,8.26 33.02,8.26 34.29,6.99 J3.2
EN-5V_TR
  Top 0.254: 15.41,13.59 T1.1
  Top 0.406: R12.1 15.41,13.59
EN_5V_OUT
  Top 0.61: T1.2 15.41,4.91 J4.2
ETH_CS
  Top 0.254: U1.32 63.38,41.8 64.14,42.55 64.14,44.25 60.13,48.26 50.16,48.26 47.62,45.72 47.62,38.73 45.72,36.83 31.81,36.83 30.4,35.42 30.4,33.83 29.59,33.02 25.34,33.02 U2.29
ETH_RESET  (via drill 0.35)
  Top 0.254: R30.1 56.29,34.7 v56.52,34.92 59.69,34.92 62.23,37.47 62.87,37.47 63.19,37.79 U1.37
  Bottom 0.254: v56.52,34.92 53.98,32.38 44.45,32.38 43.08,33.76 43.08,34.87 42.39,35.56 17.78,35.56 16.56,34.34 U2.26
GND  (via drill 0.3, 0.35, 0.5 pad 1.27)
  other vias: 10.79,26.54 18.41,24.77 43.81,8.89 24.77,12.06 10.16,22.23 10.16,20.95 67.31,48.26 71.37,43.43 66.04,42.55 67.31,43.81 67.31,40.64 62.87,43.18 63.5,40.01 76.2,45.72 71.12,36.2 26.04,43.18 41.27,27.3 59.69,17.78 13.97,20.95 8.89,46.35 78.11,36.2 36.83,44.45 81.92,31.11 83.82,40.64 53.34,46.35 71.95,40.34 16.51,29.84 58.42,38.73 34.92,55.24 10.16,19.68 37.31,51.92 62.87,29.84 96.9,45.72 91.19,40.01 83.82,38.1 83.19,44.45 82.55,46.35 56.52,36.83 50.8,38.1 64.77,40.01 66.04,40.01 67.31,41.91 66.04,43.81 63.5,43.81 83.82,36.58 83.82,33.66 78.11,33.02 62.23,20.95 54.61,23.5 88.5,14 73.66,36.2 29.84,36.83 33.65,36.18 6.49,31.75 8.89,25.4 7.62,36.2 13.97,41.27 13.97,46.35 18.41,50.8 21.59,50.8 13.97,54.61 8.89,50.8 8.89,54.61 22.23,43.18 18.41,43.18 26.04,37.47 22.23,37.47 18.41,37.47 76.5,14 73.66,23.5 77.47,23.5 79,14 69.22,14.61 59.69,15.24 59.69,20.95 58.42,29.84 66.67,29.84 18.41,19.05 20.7,20.07 15.86,32.51 58.67,42.16 73.66,21.59 77.47,21.59 94.5,13.5 76.2,43.81 55.24,45.72 55.24,43.81 29.84,43.18 13.97,50.8 96.5,13.5 81.5,14 62.87,44.45 69.47,37.21 43.18,75.56 41.27,75.56 39.37,75.56 37.47,75.56 35.56,75.56 33.66,75.56 31.75,75.56 29.84,75.56 27.94,75.56 26.04,75.56 24.13,75.56 22.23,75.56 20.32,75.56 18.41,75.56 16.51,75.56 14.61,75.56 12.7,75.56 10.79,75.56 8.89,75.56 6.99,75.56 5.08,75.56 3.17,75.56 1.91,74.93 0.64,73.66 0.64,71.75 0.64,69.85 0.64,67.94 0.64,66.04 0.64,64.14 0.64,62.23 0.64,3.17 1.91,1.91 3.17,0.64 0.64,5.08 0.64,6.99 0.64,8.89 0.64,10.79 0.64,12.7 0.64,14.61 0.64,16.51 0.64,18.41 0.64,20.32 0.64,22.23 0.64,24.13 0.64,26.04 0.64,27.94 0.64,29.84 0.64,31.75 0.64,37.47 0.64,39.37 0.64,41.27 5.08,0.64 6.99,0.64 8.89,0.64 10.79,0.64 12.7,0.64 14.61,0.64 16.51,0.64 18.41,0.64 20.32,0.64 22.23,0.64 24.13,0.64 26.04,0.64 27.94,0.64 29.84,0.64 31.75,0.64 33.66,0.64 35.56,0.64 37.47,0.64 39.37,0.64 41.27,0.64 43.18,0.64 45.09,0.64 46.99,0.64 48.9,0.64 50.8,0.64 52.7,0.64 54.61,0.64 56.52,0.64 58.42,0.64 60.33,0.64 62.23,0.64 64.14,0.64 66.04,0.64 67.94,0.64 69.85,0.64 71.75,0.64 73.66,0.64 75.56,0.64 77.47,0.64 79.38,0.64 81.28,0.64 83.19,0.64 85.09,0.64 87,0.64 88.9,0.64 90.81,0.64 92.71,0.64 94.61,0.64 96.52,0.64 98.42,0.64 100.33,0.64 102.23,0.64 104.14,0.64 106.05,0.64 107.95,0.64 109.22,1.91 110.49,3.17 110.49,5.08 110.49,6.99 110.49,8.89 110.49,10.79 110.49,12.7 110.49,14.61 110.49,16.51 110.49,18.41 110.49,20.32 110.49,22.23 47.62,54.61 49.53,54.61 51.44,54.61 53.34,54.61 55.24,54.61 57.15,54.61 59.05,54.61 60.96,54.61 62.87,54.61 64.77,54.61 66.67,54.61 68.58,54.61 70.48,54.61 72.39,54.61 74.3,54.61 76.2,54.61 78.11,54.61 80.01,54.61 81.92,54.61 83.82,54.61 85.72,54.61 104.14,73.03 104.14,71.12 104.14,69.22 106.05,68.58 107.95,68.58 107.95,66.67 107.95,64.77 107.95,62.87 107.95,60.96 108.58,59.05 108.58,57.15 108.58,55.24 108.58,53.34 108.58,51.44 108.58,49.53 108.58,47.62 108.58,45.72 108.58,43.81 108.58,41.91 108.58,40.01 108.58,38.1 108.58,36.2 108.58,33.66 108.58,31.75 108.58,29.84 108.58,27.94 108.58,26.04 108.58,24.13 47.62,51.44 50.8,51.44 53.98,51.44 57.15,51.44 73.03,51.44 76.2,51.44 79.38,51.44 82.55,51.44 89.53,45.09 89.53,41.27 26.04,16.51 29.21,16.51 32.38,16.51 35.56,15.24 38.73,15.24 41.91,15.24 45.09,15.24 49.53,15.24 52.7,15.24 55.88,15.24 43.18,23.5 51.44,25.4 49.53,23.5 53.98,27.94 29.21,31.11 32.38,31.11 35.56,31.11 19.68,29.84 21.59,27.3 24.77,27.3 27.94,27.3 10.79,30.48 64.77,8.26 58.42,8.26 52.07,8.26 41.27,8.89 69.22,8.26 72.39,8.26 75.56,8.26 78.74,8.26 59.69,24.13 59.69,27.3 89.99,18 87.3,19.8 88.5,15.5 86,17 90.5,15.5 0.64,33.11 0.64,35.57 12.5,38 11.9,57.78 11.9,45.09
  pour Bottom (rank 2, no thermals): -0.11,-0.11 111.24,-0.11 111.24,76.31 -0.11,76.31
  pour Top (rank 2, no thermals): -0.09,-0.09 111.21,-0.09 111.21,76.29 -0.09,76.29
HOME_ROR_CLOSED
  Top 0.254: U$3.P$17 17.48,47.33 17.06,46.91 17.06,37.52 16.54,36.99 11.29,36.99 8.78,34.48 U2.23
HOME_ROR_CLOSED-IN_EXT
  Top 0.61: R50.2 63.92,71.97 J8.2
HOME_ROR_CLOSED_IN_5V  (via drill 0.35)
  Top 0.254: R18.2 41.78,43.05 38.16,46.67 U$3.P$3 34.22,46.67 v33.66,47.24 | R50.1 65.62,63.08 v65.41,62.87
  Top 1.016: C46.1 R50.1
  Bottom 0.254: v65.41,62.87 60.33,57.78 40.01,57.78 33.85,51.63 33.85,47.44 v33.66,47.24
L_LED+  (via drill 0.35)
  Top 0.305: R28.1 88.78,33.54 v92.08,36.83
  Bottom 0.305: v92.08,36.83 92.33,37.08 X9.12
LINK_ACK  (via drill 0.35)
  Top 0.254: U1.25 61.13,45.3 60.16,46.27 v60.16,46.77
  Bottom 0.254: v60.16,46.77 63.76,50.37 83.62,50.37 88.25,54.99 X9.10
M_DIR
  Top 0.254: U2.24 11.31,32.5 13.46,30.35 13.46,25.53 12.38,24.45 U$1.P$3
M_DIR_5V
  Top 0.254: U$1.P$17 16.18,23.8 15.88,23.5 15.88,19.05 17.14,17.78
  Top 0.305: R22.2 17.78,17.14 17.14,17.78
M_EN
  Top 0.254: U$1.P$2 10.88,25.09 7.49,28.48 7.49,34.92 11.31,38.74 U2.15
M_EN_5V
  Top 0.254: U$1.P$18 16.06,24.45 15.24,23.62 15.24,14.61
  Top 0.305: R12.2 15.24,14.61
M_STEP
  Top 0.254: U2.7 31.64,61.08 31.11,61.59 10.88,61.59 10.03,60.75 10.03,41.02 4.95,35.94 4.95,28.07 9.22,23.8 U$1.P$4
M_STEP_5V
  Top 0.254: U$1.P$16 20.67,23.14 21.59,22.23 R41.2
N$22
  Top 0.254: R31.1 58.42,33.91 58.93,34.42 59.82,34.42 62.23,36.83 62.87,36.83 63.69,37.66 U1.38
N$23
  Top 0.254: R32.1 60.52,34.48 62.23,36.2 62.87,36.2 64.19,37.52 U1.39
N$24
  Top 0.254: R33.1 62.61,35.31 64.69,37.38 U1.40
N$25
  Top 0.254: R34.1 64.71,36.77 65.2,37.26 65.19,37.27 U1.41
N$26
  Top 0.254: R35.1 66.8,36.07 65.69,37.18 U1.42
N$27
  Top 0.254: R36.1 68.9,34.61 66.19,37.31 U1.43
N$28
  Top 0.254: R37.1 66.7,37.59 66.69,37.61 U1.44
N$29
  Top 0.254: R38.1 71.47,34.92 69.95,34.92 67.19,37.68 U1.45
N$31
  Top 0.254: C19.2 66.83,49.05 65.19,47.41 U1.20
N$33
  Top 0.254: C18.2 62.71,49.69 64.19,48.2 U1.22
N$34
  Top 0.254: U1.10 71.91,44.3 72.6,43.6 R39.1
N$35
  Top 0.254: R40.2 60.64,49.85 61.59,48.9 62.91,48.9 63.69,48.11 U1.23
PG
  Top 0.254: PS1.4 88,17.25 86.85,16.1 R7.2
R_LED+
  Top 0.305: X9.9 93.38,56.48 93.38,48.33 92.71,47.66 91.89,47.66 91.85,47.62 88.42,47.62 R29.1
RD+
  Top 0.305: C15.2 88.57,38.41 97.16,46.99 X9.7
RD-
  Top 0.305: C21.2 89.03,35.69 99.69,46.35 X9.8
RG-11
  Top 0.254: U$3.P$13 29.11,49.92 26.55,52.48 U2.9
RG-11-IN_5V  (via drill 0.35)
  Top 0.254: R4.1 39.75,51.18 37.84,49.27 U$3.P$7 33.27,49.27 v32.97,49.57 | R5.1 47.84,63.08 v47.62,62.87
  Top 1.016: R5.1 C1.1
  Bottom 0.254: v47.62,62.87 46.35,61.59 36.63,61.59 35.48,60.45 35.48,58.59 32.38,55.5 32.38,50.16 v32.97,49.57
RG-11-IN_EXT
  Top 0.61: R5.2 46.14,68.16 45.72,68.58 40.01,68.58 38.1,70.48 J7.2
ROR_OPENED
  Top 0.254: U$3.P$12 29.43,50.58 28.57,51.44 28.57,59.22 U2.8
ROR_OPENED-IN_EXT
  Top 0.61: R48.2 55.03,68.16 J9.2
ROR_OPENED_IN_5V  (via drill 0.35)
  Top 0.254: R17.2 39.24,53.21 38.73,52.7 38.73,51 37.66,49.92 U$3.P$8 33.56,49.92 v33.07,50.42 | R48.1 56.73,63.08 v56.52,62.87
  Top 1.016: R48.1 C44.1
  Bottom 0.254: v33.07,50.42 33.07,51.77 37.97,56.67 37.97,60.27 38.58,60.87 54.52,60.87 v56.52,62.87
RX2
  Top 0.254: U2.27 19,34.34 22.86,30.48 27.3,30.48 29.84,27.94 JP1.2
RXN  (via drill 0.35)
  Top 0.254: C21.1 85.86,35.66 R26.1 | U1.5 72.74,41.8 v72.85,41.68
  Top 0.305: R26.1 82.14,35.97 v81.28,36.83
  Bottom 0.254: v81.28,36.83 81.28,38.6 78.19,41.68 v72.85,41.68
RXP  (via drill 0.35)
  Top 0.254: R27.1 82.55,38.82 | 82.55,38.82 85.47,38.82 C15.1 | U1.6 71.5,42.3 v71.72,42.51 71.75,42.55 | v81.27,40.02 81.31,40.06 82.55,38.82
  Bottom 0.254: v71.72,42.51 78.77,42.51 v81.27,40.02 81.28,40.01
SCLK  (via drill 0.35)
  Top 0.254: v60.33,41.27 60.34,41.3 U1.33 | U2.30 26.55,34.69 29.91,38.04 45.09,38.1 46.35,39.37 v46.35,41.27
  Bottom 0.254: v46.35,41.27 v60.33,41.27
SDI
  Top 0.254: U1.34 63.66,40.8 64.77,41.91 64.77,44.27 60.14,48.9 49.53,48.9 46.99,46.35 46.99,38.73 45.72,37.47 31.75,37.47 29.09,34.81 U2.31
SDO  (via drill 0.35)
  Top 0.254: U1.35 60.62,40.3 59.69,39.37 59.69,36.2 59.05,35.56 v54.61,35.56
  Bottom 0.254: v54.61,35.56 52.07,33.02 45.57,33.02 44.34,34.26 U2.37
SPARE1
  Top 0.254: U$3.P$18 31.43,46.67 31.75,46.99 31.75,50.3 36.72,55.09 U2.5
SPARE1-IN_EXT
  Top 0.61: R45.2 37.25,66.89 35.56,68.58 27.94,68.58 25.4,71.12 J10.1
SPARE1_IN_5V  (via drill 0.35)
  Top 0.254: R21.2 42.29,41.02 37.29,46.02 U$3.P$2 34.59,46.02 v34.29,45.72 | v31.75,62.87 38.1,62.87 38.95,63.72 R45.1
  Top 1.016: C41.1 R45.1
  Bottom 0.254: v31.75,62.87 30.4,61.52 30.4,49.61 v34.29,45.72
SPARE2
  Top 0.254: U$3.P$14 28.83,49.27 24.02,54.09 U2.10
SPARE2-IN_EXT
  Top 0.61: R49.2 24.13,64.77 20.32,68.58 J10.2
SPARE2_IN_5V  (via drill 0.35)
  Top 0.254: R9.2 41.15,49.15 40.62,48.62 U$3.P$6 32.56,48.62 v32.53,48.59 | 33.02,64.56 v33.02,63.5
  Top 0.406: C45.1 33.02,64.56
  Top 1.016: R49.1 C45.1
  Bottom 0.254: v32.53,48.59 31.75,49.38 31.75,57.15 32.92,58.32 32.92,63.4 v33.02,63.5
SPARE_OUT1
  Top 0.254: U$1.P$5 11.7,23.11 12.05,23.11 13.97,24.97 13.97,34.23 U2.25 14,34.48 R3.2
SPARE_OUT1_5V  (via drill 0.35)
  Top 0.254: 19.18,16.76 19.18,14.1
  Top 0.305: U$1.P$15 16.78,22.5 16.51,22.23 16.51,19.43 19.18,16.76 | 19.18,14.1 20.57,12.7 v35.56,12.7 | v40.01,12.7 40.54,12.7 41.35,11.89 52.2,11.89 53.18,10.91 64.4,10.91 69.85,5.46 J12.2
  Bottom 0.305: v35.56,12.7 v40.01,12.7
SPARE_OUT2  (via drill 0.35)
  Top 0.254: 16.39,58.05 16.39,51.95 15.88,51.44 v15.88,38.1 | U2.13 16.39,58.5 16.39,58.05 | U$1.P$6 12.21,22.5 14.48,24.77 14.48,30.99 15.11,31.62 15.11,35.07 15.87,35.82 v15.88,35.82 | R1.2 16.39,58.05
  Bottom 0.254: v15.88,35.82 v15.88,38.1
SPARE_OUT2_5V  (via drill 0.35)
  Top 0.305: U$1.P$14 19.43,21.84 19.68,21.59 19.68,14.61 20.95,13.34 v34.29,13.34 | v38.1,13.34 40.01,11.43 51.92,11.43 53,10.35 59.88,10.35 64.77,5.46 J12.1
  Bottom 0.305: v34.29,13.34 v38.1,13.34
SS/TR
  Top 0.254: PS1.9 92.05,17.25 92.2,17.1 C9.1
STEP-5V_TR
  Top 0.254: T3.1 39.69,10.47 36.2,13.97 22.23,13.97 21.59,14.61
  Top 0.305: R41.1 21.59,14.61
STEP_5V_OUT
  Top 0.406: T3.2 45.89,8.09
  Top 0.61: 45.89,8.09 46.35,7.62 50.16,7.62 52.07,5.71 J1.2
SW
  pour Top (no thermals): 85.89,17.59 88.91,17.59 88.91,19.06 85.89,19.06
TX2
  Top 0.254: U2.28 21.48,32.5 22.86,31.11 27.3,31.11 32.38,26.04 JP1.1
TXN  (via drill 0.35)
  Top 0.254: R25.1 82.06,42.6 81.62,42.16 81.62,41.61 80.65,40.64 79.12,40.64 77.68,39.2 71.28,39.2 70.69,39.8 U1.1
  Top 0.305: R25.1 83.24,42.6 v83.82,43.18
  Bottom 0.305: v83.82,43.18 84.75,44.12 84.75,48.56 88.9,52.7 94.35,52.7 96.89,55.24 X9.2
TXP  (via drill 0.35)
  Top 0.254: U1.2 71.08,40.3 71.77,39.61 77.41,39.61 79.08,41.27 80.71,41.27 81.21,41.77 81.21,44.19 R24.1
  Top 0.305: R24.1 83.22,45.12 v83.82,45.72
  Bottom 0.305: v83.82,45.72 83.82,48.9 88.4,53.47 94.11,53.47 X9.1
VCC  (via drill 0.35, 0.5 pad 1.2, 0.55 pad 1.2)
  Top 0.254: PS1.14 90.25,20.35 90.1,20.5 85.75,20.5 83.75,18.5
  Top 0.406: R7.1 83.75,16.9 83.75,18.5 L1.2
  Top 0.61: T3.3 52.49,9.53 52.5,9.51 53.35,9.51 57.15,5.71 J1.3 | T2.3 36.2,10.16 39.37,6.99 J3.3 | T1.3 18.41,10.16 21.59,6.99 J4.3
  Top 0.813: v18.41,26.67 17.61,27.47 C6.1
  Top 1.27: R20.2 R17.1 R4.2 R9.1 R16.1 R15.1 R18.1 R21.1 44.66,39.5 v44.7,39.5 | v49.78,35.43 49.78,30.73 47.5,28.45 v47.5,13.34 64.77,13.34 66.45,15.01 IC8.3 66.64,18 C23.1 76.45,18 C29.2
  Bottom 1.27: 47.5,6.55 39.37,6.55 | 39.37,6.55 22.66,6.55 | v18.41,26.67 22.66,22.43 22.66,6.55 | v47.5,13.34 47.5,6.55 | U2.19 1.16,43.31 5.01,39.44 43.18,39.37 44.58,39.37 | 44.58,39.37 v44.7,39.5 | v49.78,35.43 49.66,35.56 48.9,35.56 45.09,39.37 44.58,39.37 | 22.66,6.55 21.59,5.49 J4.3 | 39.37,6.55 J3.3 | 47.5,6.55 47.7,6.35 55.88,6.35 57.15,5.08 J1.3
  pour Top (no thermals): 16.89,25.65 18.8,25.65 18.8,27.94 16.89,27.94
  pour Top (no thermals): 74.99,16.99 84.71,16.99 84.71,20.01 74.99,20.01
XI
  Top 0.305: U1.30 60.27,42.79 25MHZ.3

### Text on the board
tPlace: SPARE2 | SPARE1 | GND | RAIN | 12V | RoR Opened | GND | Home | GND | West | East | GND | At Park | GND | RoR Closed | Close RoR | Open RoR | Dome Rotator / RoR | GND | GND | RX | TX | +12V | GND | EN | +5V | GND | DIR | +5V | GND | STEP | +5V
bPlace: SPARE2 | SPARE1 | GND | RAIN | 12V | RoR Opened | GND | RoR Closed / Home | GND | Close RoR / West | Open RoR / East | GND | At Park | GND | GND | EN | +5V | GND | DIR | +5V | GND | STEP | +5V | Spare Out 2 | Spare Out 1